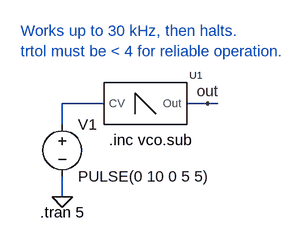
[diagram p0: schematic vco_test_jig.asc]
vco_test_jig.asc, the LTspice schematic file:
Version 4
SHEET 1 880 680
WIRE 128 144 64 144
WIRE 288 144 256 144
WIRE 304 144 288 144
WIRE 64 176 64 144
WIRE 64 288 64 256
FLAG 64 288 0
FLAG 288 144 out
SYMBOL vco 192 96 R0
SYMATTR InstName U1
SYMBOL voltage 64 160 R0
WINDOW 123 0 0 Left 0
WINDOW 39 0 0 Left 0
SYMATTR InstName V1
SYMATTR Value PULSE(0 10 0 5 5)
TEXT 30 312 Left 2 !.tran 5
TEXT 136 200 Left 2 !.inc vco.sub
TEXT 0 32 Left 2 ;Works up to 30 kHz, then halts.\ntrtol must be < 4 for reliable operation.

The netlist it stands for:
* vco_test_jig.asc
XU1 N001 out vco  ; pins CV Out
V1 N001 0 PULSE(0 10 0 5 5)
.tran 5
.inc vco.sub
* Works up to 30 kHz, then halts.
* trtol must be < 4 for reliable operation.
.backanno
.end